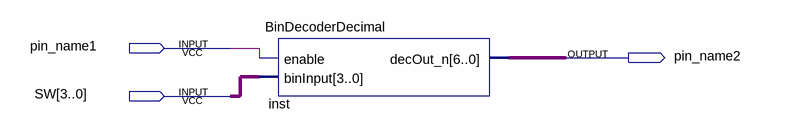
[diagram p0: schematic sheet]
// Quartus schematic BinDecDecimal.bdf as structural Verilog: 1 symbols, 3 pins
module BinDecDecimal (
  input  pin_name1,
  input  [3:0] SW,
  output pin_name2
);

  wire [6:0] inst_decout_n;

  BinDecoderDecimal inst (.enable(pin_name1), .binInput(SW), .decOut_n(inst_decout_n));
endmodule
